# EAGLE schematic module-schematic (EAGLE 9.6.2)
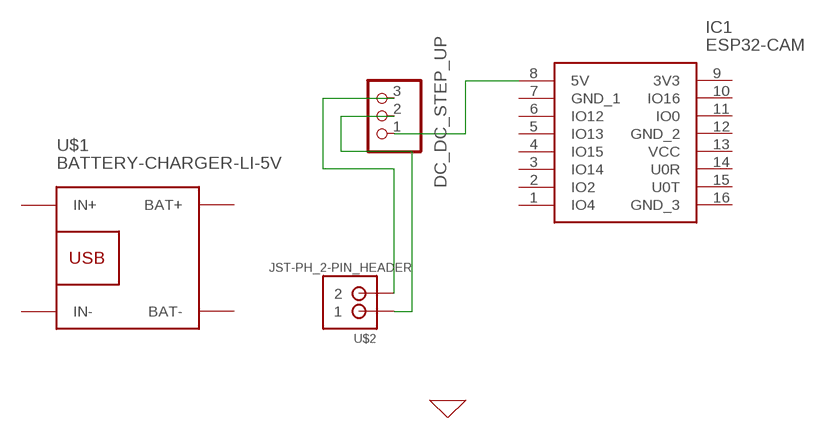
[diagram p0: schematic, sheet 1]

## Parts
DC_DC_STEP_UP  PINHD-1X3  [1X03]
IC1  ESP32-CAM  [ESP32CAM]
U$1  BATTERY-CHARGER-LI-5V  [BATTERY-CHARGER-LI-5V]
U$2  JST-PH_2-PIN_HEADER  [JST_B2B-PH_HEADER]

## Nets
N$1: DC_DC_STEP_UP.3 U$2.P2
N$2: DC_DC_STEP_UP.2 U$2.P1
N$3: DC_DC_STEP_UP.1 IC1.8(5V)
Unconnected: IC1.1(IO4) IC1.2(IO2) IC1.3(IO14) IC1.4(IO15) IC1.5(IO13) IC1.6(IO12) IC1.7(GND_1) IC1.9(3V3) IC1.10(IO16) IC1.11(IO0) IC1.12(GND_2) IC1.13(VCC) IC1.14(U0R) IC1.15(U0T) IC1.16(GND_3) U$1.BAT+ U$1.BAT- U$1.IN+ U$1.IN-

## Library data of the parts
DC_DC_STEP_UP = pinhead:PINHD-1X3: PIN HEADER
IC1 = ESP32-CAM:ESP32-CAM: Modules PCBA Module RoHS Source: Datasheet <https://datasheet.lcsc.com/szlcsc/Ai-Thinker-ESP32-CAM_C277946.pdf>; DESCRIPTION: Modules PCBA Module RoHS; HEIGHT: 5mm; MANUFACTURER_NAME: Ai-Thinker; MANUFACTURER_PART_NUMBER: ESP32-CAM
U$1 = diy-modules:BATTERY-CHARGER-LI-5V: Lithium Battery 5V Charger More details available here: http://www.buildcircuit.com/how-to-use-micro-usb-5v-1a-lithium-battery-charging-board-charger-module/ Click here to find device on ebay.com <http://www.ebay.com/sch/tp4056+charger+usb>
U$2 = SRG:JST-PH_2-PIN_HEADER: 2-pin JST PH Shrouded Header, top entry P/N B2B-PH-K-S Mating connector PHR-2 Mating cable assembly: Sparkfun PRT-09914 <http://www.sparkfun.com/products/9914>